# Altium schematic sheet MCU.SchDoc
size A
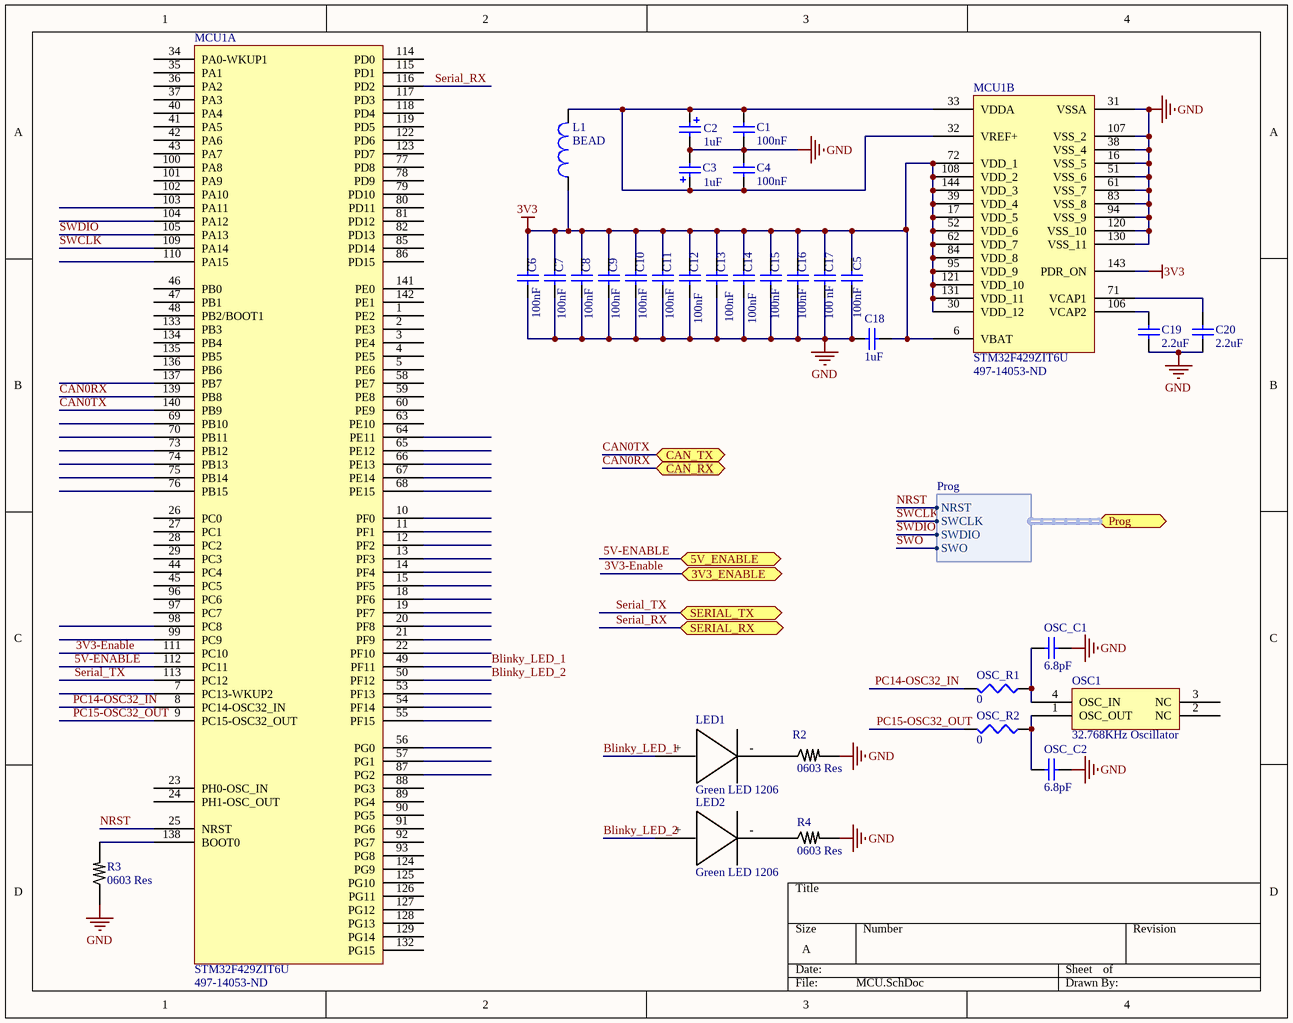
[diagram p0: MCU.SchDoc]

## Parts
C1  value 100nF  [SMD0603]  (hidden comment: Cap)
C2  value 1uF  [SMD1206 Polarized]  (hidden comment: Cap)
C3  value 1uF  [SMD1206 Polarized]  (hidden comment: Cap)
C4  value 100nF  [SMD0603]  (hidden comment: Cap)
C5  value 100nF  [SMD0603]  (hidden comment: Cap)
C6  value 100nF  [SMD0603]  (hidden comment: Cap)
C7  value 100nF  [SMD0603]  (hidden comment: Cap)
C8  value 100nF  [SMD0603]  (hidden comment: Cap)
C9  value 100nF  [SMD0603]  (hidden comment: Cap)
C10  value 100nF  [SMD0603]  (hidden comment: Cap)
C11  value 100nF  [SMD0603]  (hidden comment: Cap)
C12  value 100nF  [SMD0603]  (hidden comment: Cap)
C13  value 100nF  [SMD0603]  (hidden comment: Cap)
C14  value 100nF  [SMD0603]  (hidden comment: Cap)
C15  value 100nF  [SMD0603]  (hidden comment: Cap)
C16  value 100nF  [SMD0603]  (hidden comment: Cap)
C17  value 100 nF  [SMD0603]  (hidden comment: Cap)
C18  value 1uF  [SMD0603]  (hidden comment: Cap)
C19  value 2.2uF  [SMD1206]  (hidden comment: Cap)
C20  value 2.2uF  [SMD1206]  (hidden comment: Cap)
L1  BEAD  [SMD0603]
LED1  Green LED 1206  [Panel_Mount_LED]
LED2  Green LED 1206  [Panel_Mount_LED]
MCU1  STM32F429ZIT6U  Supplier Part Number 1: 497-14053-ND  [LQPF144]  (parts A,B of 2)
OSC1  32.768KHz Oscillator  [MC-306-OSC]
OSC_C1  value 6.8pF  [SMD0603]  (hidden comment: Cap)
OSC_C2  value 6.8pF  [SMD0603]  (hidden comment: Cap)
OSC_R1  value 0  [SMD0603]  (hidden comment: Res)
OSC_R2  value 0  [SMD0603]  (hidden comment: Res)
R2  0603 Res  [0603/1608 SMD Resistor]
R3  0603 Res  [0603/1608 SMD Resistor]
R4  0603 Res  [0603/1608 SMD Resistor]

## Ports
3V3_ENABLE (bidir), 5V_ENABLE (bidir), CAN_RX (bidir), CAN_TX (bidir), Prog (harness Prog), SERIAL_RX, SERIAL_TX

## Harnesses
Prog: NRST, SWCLK, SWDIO, SWO

## Nets
3V3: C5.1 C6.2 C7.2 C8.2 C9.2 C10.2 C11.2 C12.2 C13.2 C14.2 C15.2 C16.2 C17.2 C18.1 L1.1 MCU1.6(VBAT) MCU1.17(VDD_5) MCU1.30(VDD_12) MCU1.39(VDD_4) MCU1.52(VDD_6) MCU1.62(VDD_7) MCU1.72(VDD_1) MCU1.84(VDD_8) MCU1.95(VDD_9) MCU1.108(VDD_2) MCU1.121(VDD_10) MCU1.131(VDD_11) MCU1.143(PDR_ON) MCU1.144(VDD_3)
GND: C1.1 C2.2 C3.2 C4.2 C5.2 C6.1 C7.1 C8.1 C9.1 C10.1 C11.1 C12.1 C13.1 C14.1 C15.1 C16.1 C17.1 C18.2 C19.1 C20.1 MCU1.16(VSS_5) MCU1.31(VSSA) MCU1.38(VSS_4) MCU1.51(VSS_6) MCU1.61(VSS_7) MCU1.83(VSS_8) MCU1.94(VSS_9) MCU1.107(VSS_2) MCU1.120(VSS_10) MCU1.130(VSS_11) OSC_C1.1 OSC_C2.1 R2.2 R3.1 R4.2
3V3-Enable: MCU1.111(PC10) ; port 3V3_ENABLE
5V-ENABLE: MCU1.112(PC11) ; port 5V_ENABLE
Blinky_LED_1: LED1.+ MCU1.49(PF11)
Blinky_LED_2: LED2.+ MCU1.50(PF12)
CAN0RX: MCU1.139(PB8) ; port CAN_RX
CAN0TX: MCU1.140(PB9) ; port CAN_TX
NRST: MCU1.25(NRST) ; port Prog.NRST
PC14-OSC32_IN: MCU1.8(PC14-OSC32_IN) OSC_R1.2
PC15-OSC32_OUT: MCU1.9(PC15-OSC32_OUT) OSC_R2.2
Serial_RX: MCU1.116(PD2) ; port SERIAL_RX
Serial_TX: MCU1.113(PC12) ; port SERIAL_TX
SWCLK: MCU1.109(PA14) ; port Prog.SWCLK
SWDIO: MCU1.105(PA13) ; port Prog.SWDIO
SWO: port Prog.SWO
NetC1_2: C1.2 C2.1 C3.1 C4.1 L1.2 MCU1.32(VREF+) MCU1.33(VDDA)
NetC19_2: C19.2 MCU1.106(VCAP2)
NetC20_2: C20.2 MCU1.71(VCAP1)
NetLED1_-: LED1.- R2.1
NetLED2_-: LED2.- R4.1
NetMCU1_138: MCU1.138(BOOT0) R3.2
NetOSC1_1: OSC1.1(OSC_OUT) OSC_C2.2 OSC_R2.1
NetOSC1_4: OSC1.4(OSC_IN) OSC_C1.2 OSC_R1.1

Not connected (* = marked no-connect by the designer): MCU1 1(PE2) 2(PE3) 3(PE4) 4(PE5) 5(PE6) 7(PC13-WKUP2) 10(PF0) 11(PF1) 12(PF2) 13(PF3) 14(PF4) 15(PF5) 18(PF6) 19(PF7) 20(PF8) 21(PF9) 22(PF10) 23(PH0-OSC_IN) 24(PH1-OSC_OUT) 26(PC0) 27(PC1) 28(PC2) 29(PC3) 34(PA0-WKUP1) 35(PA1) 36(PA2) 37(PA3) 40(PA4) 41(PA5) 42(PA6) 43(PA7) 44(PC4) 45(PC5) 46(PB0) 47(PB1) 48(PB2/BOOT1) 53(PF13) 54(PF14) 55(PF15) 56(PG0) 57(PG1) 58(PE7) 59(PE8) 60(PE9) 63(PE10) 64(PE11) 65(PE12) 66(PE13) 67(PE14) 68(PE15) 69(PB10) 70(PB11) 73(PB12) 74(PB13) 75(PB14) 76(PB15) 77(PD8) 78(PD9) 79(PD10) 80(PD11) 81(PD12) 82(PD13) 85(PD14) 86(PD15) 87(PG2) 88(PG3) 89(PG4) 90(PG5) 91(PG6) 92(PG7) 93(PG8) 96(PC6) 97(PC7) 98(PC8) 99(PC9) 100(PA8) 101(PA9) 102(PA10) 103(PA11) 104(PA12) 110(PA15) 114(PD0) 115(PD1) 117(PD3) 118(PD4) 119(PD5) 122(PD6) 123(PD7) 124(PG9) 125(PG10) 126(PG11) 127(PG12) 128(PG13) 129(PG14) 132(PG15) 133(PB3) 134(PB4) 135(PB5) 136(PB6) 137(PB7) 141(PE0) 142(PE1); OSC1 2(NC) 3(NC)

## Library data of the parts
C1 C4-C20 OSC_C1 OSC_C2 = Capacitor Ceramic: Ceramic Chip Capacitor
C2 C3 = Capacitor Polarized: Polarized Capacitor (Surface Mount)
L1 = Chip Ferrite Bead: Ferrite Bead; Part: BK1608HS601-TV
LED1 LED2 = 1206 Green LED: Green surface mount LED
OSC1 = MC-306 32.768K-E3: 32.7680kHz Oscillator
OSC_R1 OSC_R2 = Resistor
MCU1 = STM32F429ZIT6U: Supplier 1: Digi-Key